# Altium schematic sheet Sheet2.SchDoc
size A4
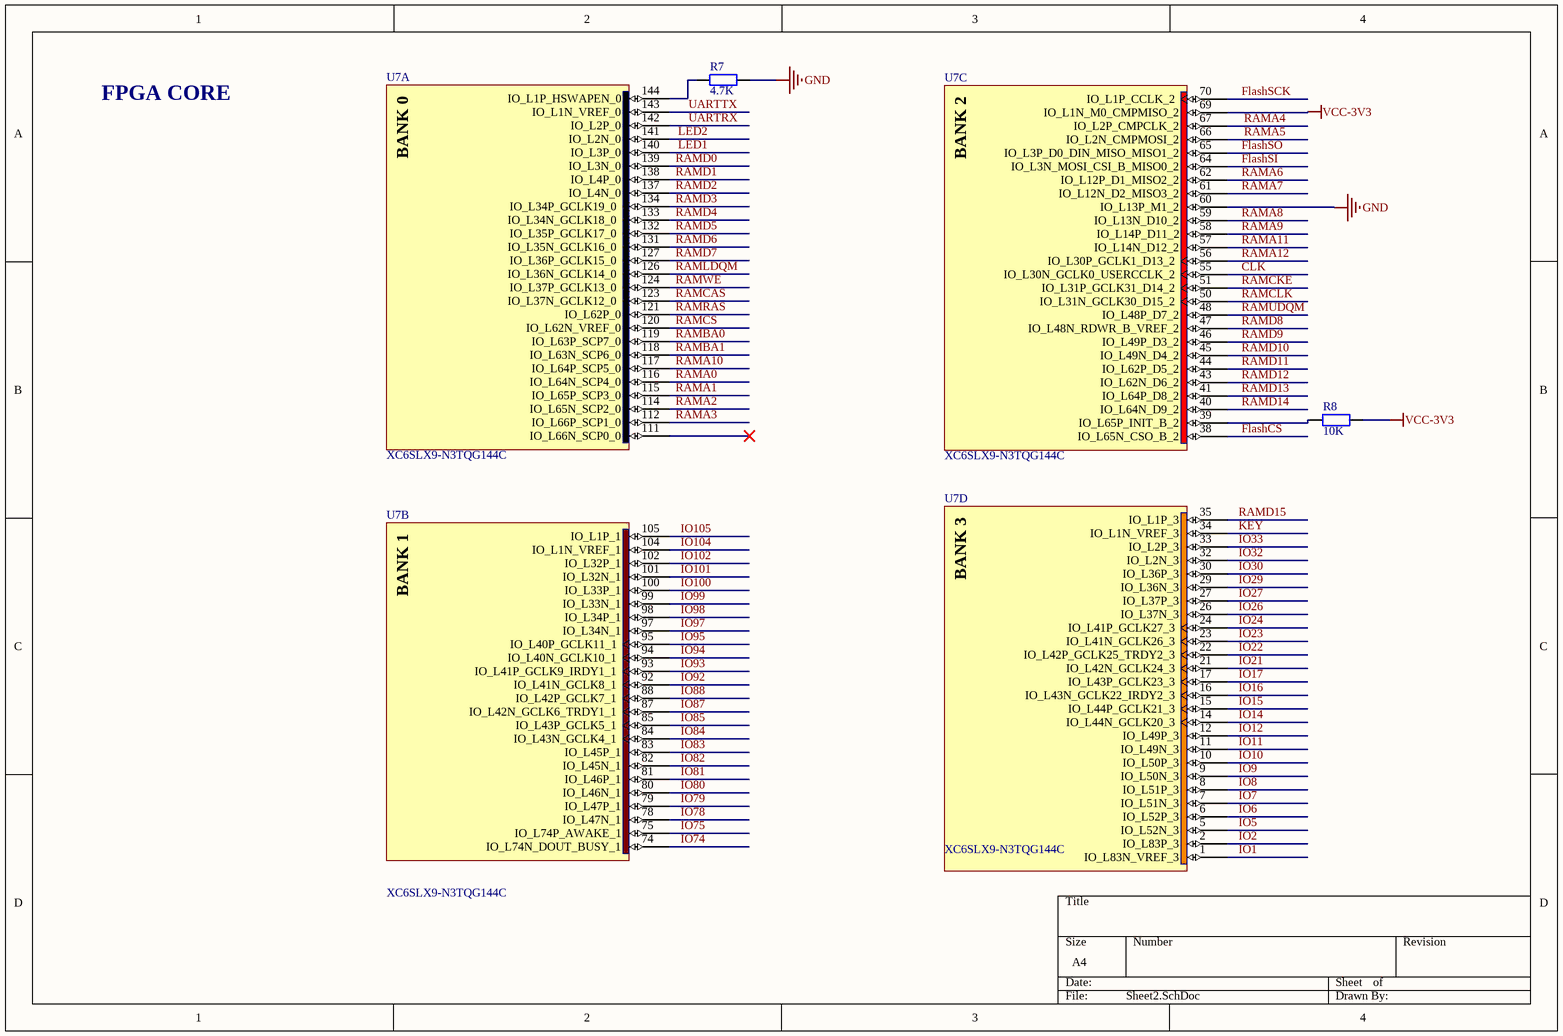
[diagram p0: Sheet2.SchDoc]

## Parts
R7  4.7K  [0603_R]
R8  10K  [0603_R]
U7  XC6SLX9-N3TQG144C  [TQG144_N]  (parts A,B,C,D of 7)

## Nets
GND: R7.2 U7.60(IO_L13P_M1_2)
VCC-3V3: R8.1 U7.69(IO_L1N_M0_CMPMISO_2)
CLK: U7.55(IO_L30N_GCLK0_USERCCLK_2)
FlashCS: U7.38(IO_L65N_CSO_B_2)
FlashSCK: U7.70(IO_L1P_CCLK_2)
FlashSI: U7.64(IO_L3N_MOSI_CSI_B_MISO0_2)
FlashSO: U7.65(IO_L3P_D0_DIN_MISO_MISO1_2)
IO1: U7.1(IO_L83N_VREF_3)
IO2: U7.2(IO_L83P_3)
IO5: U7.5(IO_L52N_3)
IO6: U7.6(IO_L52P_3)
IO7: U7.7(IO_L51N_3)
IO8: U7.8(IO_L51P_3)
IO9: U7.9(IO_L50N_3)
IO10: U7.10(IO_L50P_3)
IO11: U7.11(IO_L49N_3)
IO12: U7.12(IO_L49P_3)
IO14: U7.14(IO_L44N_GCLK20_3)
IO15: U7.15(IO_L44P_GCLK21_3)
IO16: U7.16(IO_L43N_GCLK22_IRDY2_3)
IO17: U7.17(IO_L43P_GCLK23_3)
IO21: U7.21(IO_L42N_GCLK24_3)
IO22: U7.22(IO_L42P_GCLK25_TRDY2_3)
IO23: U7.23(IO_L41N_GCLK26_3)
IO24: U7.24(IO_L41P_GCLK27_3)
IO26: U7.26(IO_L37N_3)
IO27: U7.27(IO_L37P_3)
IO29: U7.29(IO_L36N_3)
IO30: U7.30(IO_L36P_3)
IO32: U7.32(IO_L2N_3)
IO33: U7.33(IO_L2P_3)
IO74: U7.74(IO_L74N_DOUT_BUSY_1)
IO75: U7.75(IO_L74P_AWAKE_1)
IO78: U7.78(IO_L47N_1)
IO79: U7.79(IO_L47P_1)
IO80: U7.80(IO_L46N_1)
IO81: U7.81(IO_L46P_1)
IO82: U7.82(IO_L45N_1)
IO83: U7.83(IO_L45P_1)
IO84: U7.84(IO_L43N_GCLK4_1)
IO85: U7.85(IO_L43P_GCLK5_1)
IO87: U7.87(IO_L42N_GCLK6_TRDY1_1)
IO88: U7.88(IO_L42P_GCLK7_1)
IO92: U7.92(IO_L41N_GCLK8_1)
IO93: U7.93(IO_L41P_GCLK9_IRDY1_1)
IO94: U7.94(IO_L40N_GCLK10_1)
IO95: U7.95(IO_L40P_GCLK11_1)
IO97: U7.97(IO_L34N_1)
IO98: U7.98(IO_L34P_1)
IO99: U7.99(IO_L33N_1)
IO100: U7.100(IO_L33P_1)
IO101: U7.101(IO_L32N_1)
IO102: U7.102(IO_L32P_1)
IO104: U7.104(IO_L1N_VREF_1)
IO105: U7.105(IO_L1P_1)
KEY: U7.34(IO_L1N_VREF_3)
LED1: U7.140(IO_L3P_0)
LED2: U7.141(IO_L2N_0)
RAMA0: U7.116(IO_L64N_SCP4_0)
RAMA1: U7.115(IO_L65P_SCP3_0)
RAMA2: U7.114(IO_L65N_SCP2_0)
RAMA3: U7.112(IO_L66P_SCP1_0)
RAMA4: U7.67(IO_L2P_CMPCLK_2)
RAMA5: U7.66(IO_L2N_CMPMOSI_2)
RAMA6: U7.62(IO_L12P_D1_MISO2_2)
RAMA7: U7.61(IO_L12N_D2_MISO3_2)
RAMA8: U7.59(IO_L13N_D10_2)
RAMA9: U7.58(IO_L14P_D11_2)
RAMA10: U7.117(IO_L64P_SCP5_0)
RAMA11: U7.57(IO_L14N_D12_2)
RAMA12: U7.56(IO_L30P_GCLK1_D13_2)
RAMBA0: U7.119(IO_L63P_SCP7_0)
RAMBA1: U7.118(IO_L63N_SCP6_0)
RAMCAS: U7.123(IO_L37N_GCLK12_0)
RAMCKE: U7.51(IO_L31P_GCLK31_D14_2)
RAMCLK: U7.50(IO_L31N_GCLK30_D15_2)
RAMCS: U7.120(IO_L62N_VREF_0)
RAMD0: U7.139(IO_L3N_0)
RAMD1: U7.138(IO_L4P_0)
RAMD2: U7.137(IO_L4N_0)
RAMD3: U7.134(IO_L34P_GCLK19_0)
RAMD4: U7.133(IO_L34N_GCLK18_0)
RAMD5: U7.132(IO_L35P_GCLK17_0)
RAMD6: U7.131(IO_L35N_GCLK16_0)
RAMD7: U7.127(IO_L36P_GCLK15_0)
RAMD8: U7.47(IO_L48N_RDWR_B_VREF_2)
RAMD9: U7.46(IO_L49P_D3_2)
RAMD10: U7.45(IO_L49N_D4_2)
RAMD11: U7.44(IO_L62P_D5_2)
RAMD12: U7.43(IO_L62N_D6_2)
RAMD13: U7.41(IO_L64P_D8_2)
RAMD14: U7.40(IO_L64N_D9_2)
RAMD15: U7.35(IO_L1P_3)
RAMLDQM: U7.126(IO_L36N_GCLK14_0)
RAMRAS: U7.121(IO_L62P_0)
RAMUDQM: U7.48(IO_L48P_D7_2)
RAMWE: U7.124(IO_L37P_GCLK13_0)
UARTRX: U7.142(IO_L2P_0)
UARTTX: U7.143(IO_L1N_VREF_0)
NetR7_1: R7.1 U7.144(IO_L1P_HSWAPEN_0)
NetR8_2: R8.2 U7.39(IO_L65P_INIT_B_2)

Not connected (* = marked no-connect by the designer): U7 111(IO_L66N_SCP0_0)*

## Notes on the sheet
- FPGA CORE
- (in symbol XC6SLX9-N3TQG144C, part A) BANK 0
- (in symbol XC6SLX9-N3TQG144C, part B) BANK 1
- (in symbol XC6SLX9-N3TQG144C, part C) BANK 2
- (in symbol XC6SLX9-N3TQG144C, part D) BANK 3

## Library data of the parts
R7 R8 = 0603 9.1KΩ (9101) 1%: 贴片电阻; ComponentLink1Description: 供应商链接; ComponentLink1URL: http://www.szlcsc.com/product/details_23987.html; Package: 0603; Supplier: LC; SuppliersPartNumber: C23260
U7 = XC6SLX9-N3TQG144C: Spartan-6 LX 1.2V FPGA, 102 User I/Os, 144-Pin TQFP (0.5mm Pitch), Speed Grade 3N, Commercial Grade, Pb-Free; Published: 24-Aug-2010; DatasheetVersion: ver1.6, Nov-2010; PackageVersion: ver1.2, Jun-2004; PackageReference: TQG144; Publisher: Altium Limited; PackageDescription: 144-Pin Thin Quad Flat Pack (TQG144) - Pb-Free; Code_JEDEC: MS-026-BFB; ComponentLink1Description: Manufacturer Link; ComponentLink1URL: http://www.xilinx.com; ComponentLink2Description: Spartan-6 Datasheet; ComponentLink2URL: http://www.xilinx.com/support/documentation/data_sheets/ds160.pdf; ComponentLink3Description: Spartan-6 Documents; ComponentLink3URL: http://www.xilinx.com/support/documentation/spartan-6.htm; ComponentLink4Description: Xilinx.com Home; ComponentLink4URL: http://www.xilinx.com